# Altium schematic sheet 配套图1.SchDoc
size A3
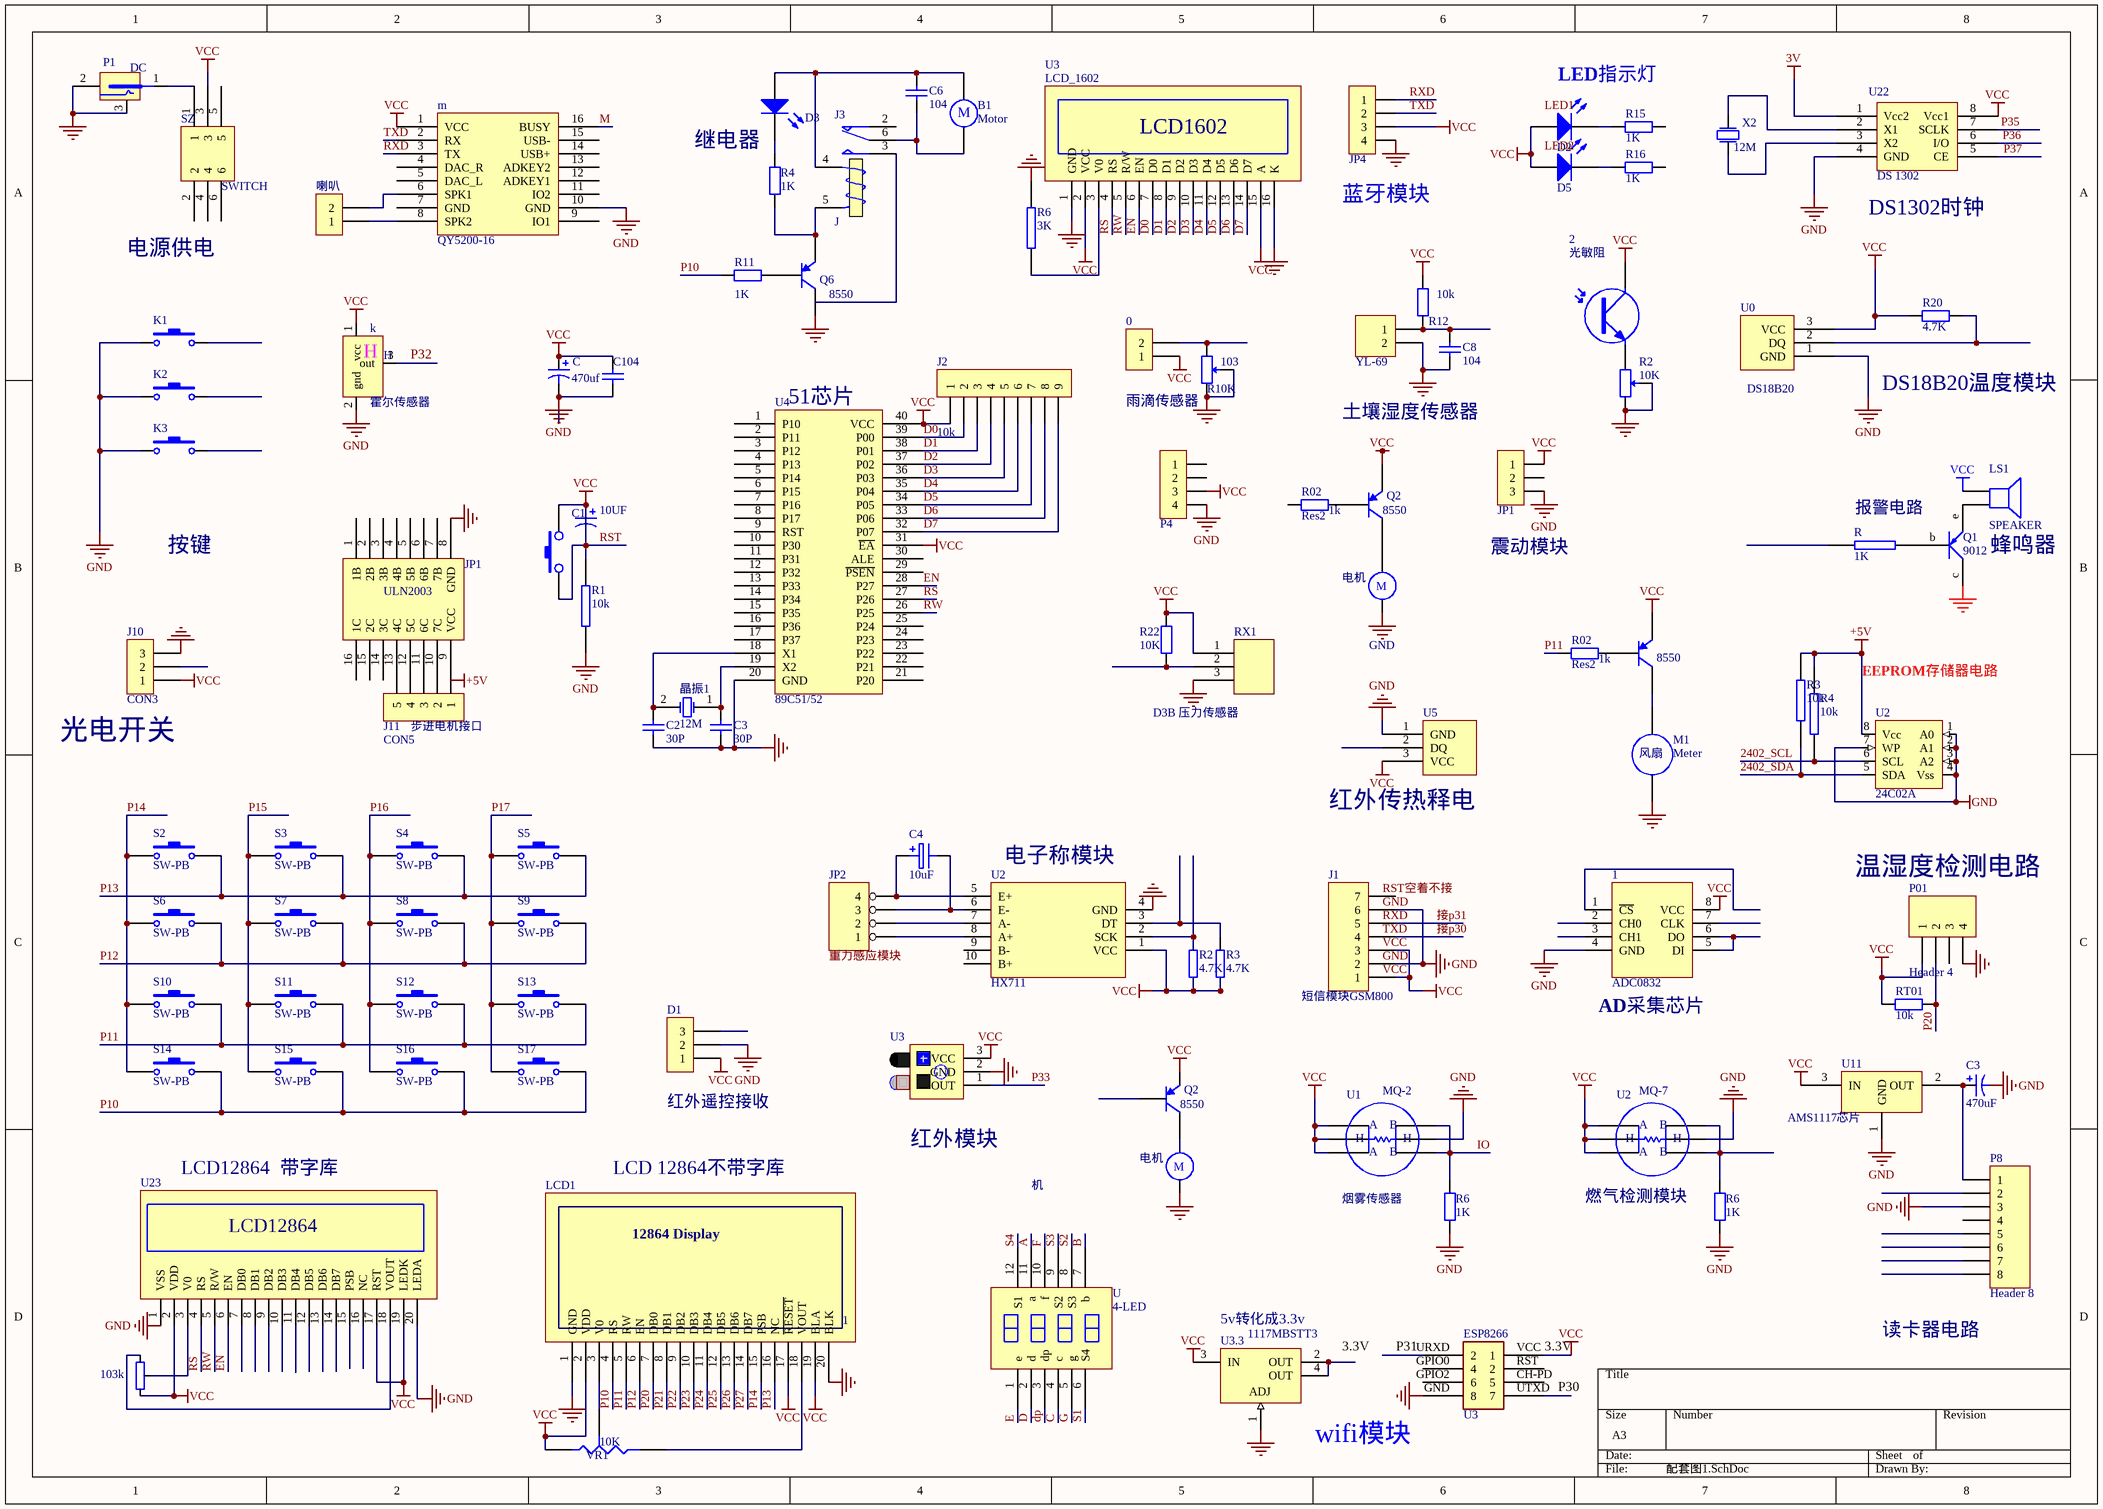
[diagram p0: 配套图1.SchDoc]

## Parts
(Parts that share a designator on the sheet are numbered #1, #2 ... from top to bottom, then left to right.)
0  (no value)
1  ADC0832
2  光敏阻
103k  (no value)  [RT1]
?#1  (no value)  [SWITCH]
?#2  8550  [BCY-W3/E4]
B1  Motor  [2ZHEN]
C  value 470uf  [B]
C1  10UF  [CD4]
C2  30P  [CB1]
C3#1  30P  [CB1]
C3#2  470uF  [电解电容]
C4  10uF  [CD5.254]
C6  104  [RAD0.1]
C8  CAP  [CAP-100]  (value not drawn)
C104  (no value)  [CAP]
D1  (no value)
D2  LED  [led]  (value not drawn)
D3  LED  [led]  (value not drawn)
D5  LED  [led]  (value not drawn)
ESP8266  U3  [HDR2X4]
J1  短信模块GSM800  [HDR1X7]
J2  10k  [SIP9]
J3  J  [JIDIANQI]
J10  CON3
J11  CON5  [SIP5]
JP1#1  HDR-1X3  [HDR-1X3]  (value not drawn)
JP1#2  ULN2003  [DIP16]
JP2  (no value)  [SIP4]
JP4  HDR-1X4  [HDR-1X4]  (value not drawn)
k  H  [DS18B20]
K1  KEY  [TSW SMD-4*4*1.5]  (value not drawn)
K2  KEY  [TSW SMD-4*4*1.5]  (value not drawn)
K3  KEY  [TSW SMD-4*4*1.5]  (value not drawn)
LCD1  1  [12864]
LS1  SPEAKER
m  QY5200-16  [QY5200]
M1  Meter  [RAD-0.1]
P1  DC  [DC2.1]
P01  Header 4  [HDR1X4]
P4  HDR-1X4  [HDR-1X4]  (value not drawn)
P8  Header 8  [HDR1X8]
Q1  9012  [TO-92B]
Q2#1  8550  [SJG-EBC]
Q2#2  8550  [SJG-EBC]
Q6  8550  [TO-sanjiguan]
R  1K  [R-DIP]
R1  10k  [1/4W]
R2#1  10K  [VR5]
R02#1  Res2  value 1k  [AXIAL-0.4]
R02#2  Res2  value 1k  [AXIAL-0.4]
R2#2  4.7K  [1/4W]
R3#1  10k  [1/4W]
R3#2  4.7K  [1/4W]
R4#1  1K  [RES]
R4#2  10k  [1/4W]
R6#1  3K  [R-DIP]
R6#2  1K  [RES]
R6#3  1K  [RES]
R10K  103  [VR5]
R11  1K  [AXIAL-0.3]
R12  RES0.4  [RES0.4]  (value not drawn)
R15  1K  [RES]
R16  1K  [RES]
R20  value 4.7K  [直插式电阻]  (hidden comment: Res2)
R22  RES0.4  [AXIAL-0.3]  (value not drawn)
RT01  value 10k  [AXIAL-0.3]  (hidden comment: Res2)
RX1  D3B 压力传感器  [3ZHEN]
S2  SW-PB  [SPST-2]
S3  SW-PB  [SPST-2]
S4  SW-PB  [SPST-2]
S5  SW-PB  [SPST-2]
S6  SW-PB  [SPST-2]
S7  SW-PB  [SPST-2]
S8  SW-PB  [SPST-2]
S9  SW-PB  [SPST-2]
S10  SW-PB  [SPST-2]
S11  SW-PB  [SPST-2]
S12  SW-PB  [SPST-2]
S13  SW-PB  [SPST-2]
S14  SW-PB  [SPST-2]
S15  SW-PB  [SPST-2]
S16  SW-PB  [SPST-2]
S17  SW-PB  [SPST-2]
SZ  SWITCH  [SW6]
U  4-LED  [LED-4]
U0  DS18B20  [TO-92]
U1  MQ-2  [MQ-2]
U2#1  24C02A  [DIP8]
U2#2  HX711  [HX711]
U2#3  MQ-7  [MQ-2]
U3#1  LCD_1602  [LCD1602]
U3#2  (no value)
U3.3  1117MBSTT3  [318E-04]
U4  89C51/52  [DIP40]
U5  红外传热释电  [DS18B20]
U11  AMS1117芯片  [AMS1117]
U22  DS 1302  [DS1302 - duplicate]
U23  LCD12864  带字库  [SIP20]
VR1  12864  [RW]  (value not drawn)
X2  12M  [XTAL-3X10]
喇叭  (no value)
土壤湿度传感器  YL-69  [2ZHEN]
晶振1  12M  [JZ2]
电机#1  GND  [RB5-10.5]
电机#2  机  [RB5-10.5]

## Nets
3.3V: 0.1 1.8(VCC) 2.1(C) 103k.2 ?#1.1 ?#1.2 ?#2.1(E) C.1 C1.1 C1.2 C104.2 D1.1 D2.1(A) D5.1(A) ESP8266.VCC(1) J1.1 J1.3 J2.1 J10.1 JP1#1.1 JP4.3 k.1(vcc) LCD1.2(VDD) LCD1.17(~{RESET}) LCD1.19(BLA) LS1.1 m.1(VCC) P01.1 P4.3 Q2#1.1(E) R1.1 R2#2.1 R3#2.1 R12.2 R20.1 R22.2 RT01.2 RX1.1 SZ.3 U0.3(VCC) U1.1 U1.2 U1.3 U2#2.1(VCC) U2#3.1 U2#3.2 U2#3.3 U3#1.2(VCC) U3#1.15(A) U3#2.3(VCC) U3.3.3(IN) U4.31(~{EA}) U4.40(VCC) U5.3(VCC) U11.3(IN) U22.8(Vcc1) U23.2(VDD) U23.17(RST) U23.19(LEDK) VR1.1  [also labelled RST, VCC]
3V: U22.1(Vcc2)
+5V: JP1#2.9(VCC) R3#1.2 R4#2.2 U2#1.8(Vcc)
GND: 1.4(GND) C.2 C2.1 C3#1.1 C8.2 C104.1 D1.2 ESP8266.GND(8) J1.2 J1.6 J10.3 JP1#1.3 JP1#2.8(GND) JP4.4 k.2(gnd) K1.1 K2.1 K3.1 LCD1.1(GND) LCD1.20(BLK) m.10(GND) M1.1 P1.2 P1.3 P01.4 P4.4 P8.3 Q1.c Q6.1(C) R1.2 R2#1.2 R2#1.3 R6#1.1 R6#2.1 R6#3.1 R10K.2 R10K.3 RX1.3(-1) U0.1(GND) U1.5 U2#1.1(A0) U2#1.2(A1) U2#1.3(A2) U2#1.4(Vss) U2#1.7(WP) U2#2.4(GND) U2#3.5 U3#1.1(GND) U3#1.16(K) U3#2.2(GND) U3.3.1(ADJ) U4.20(GND) U5.1(GND) U22.4(GND) U23.1(VSS) U23.20(LEDA) 土壤湿度传感器.2
2402_SCL: R4#2.1 U2#1.6(SCL)
2402_SDA: R3#1.1 U2#1.5(SDA)
A: U.11(a)
B: U.7(b)
C: U.4(c)
D: U.2(d)
D0: J2.2 U3#1.7(D0) U4.39(P00)
D1: J2.3 U3#1.8(D1) U4.38(P01)
D2: J2.4 U3#1.9(D2) U4.37(P02)
D3: J2.5 U3#1.10(D3) U4.36(P03)
D4: J2.6 U3#1.11(D4) U4.35(P04)
D5: J2.7 U3#1.12(D5) U4.34(P05)
D6: J2.8 U3#1.13(D6) U4.33(P06)
D7: J2.9 U3#1.14(D7) U4.32(P07)
dp: U.3(dp)
E: U.1(e)
EN: U3#1.6(EN) U4.28(P27) U23.6(EN)
F: U.10(f)
G: U.5(g)
IO: R6#2.2 U1.4 U1.6
M: m.16(BUSY)
P10: LCD1.4(RS) R11.1 S14.2 S15.2 S16.2 S17.2
P11: LCD1.5(RW) R02#2.1 S10.2 S11.2 S12.2 S13.2
P12: LCD1.6(EN) S6.2 S7.2 S8.2 S9.2
P13: LCD1.16(NC) S2.2 S3.2 S4.2 S5.2
P14: LCD1.15(PSB) S2.1 S6.1 S10.1 S14.1
P15: S3.1 S7.1 S11.1 S15.1
P16: S4.1 S8.1 S12.1 S16.1
P17: S5.1 S9.1 S13.1 S17.1
P20: LCD1.7(DB0) P01.2 RT01.1
P21: LCD1.8(DB1)
P22: LCD1.9(DB2)
P23: LCD1.10(DB3)
P24: LCD1.11(DB4)
P25: LCD1.12(DB5)
P26: LCD1.13(DB6)
P27: LCD1.14(DB7)
P30: ESP8266.UTXD(7)
P31: ESP8266.URXD(2)
P32: k.3(out)
P33: U3#2.1(OUT)
P35: U22.7(SCLK)
P36: U22.6(I/O)
P37: U22.5(CE)
RS: U3#1.4(RS) U4.27(P26) U23.4(RS)
RW: U3#1.5(R/W) U4.26(P25) U23.5(R/W)
RXD: JP4.1 m.3(TX)
S1: U.6(S4)
S2: U.8(S3)
S3: U.9(S2)
S4: U.12(S1)
TXD: JP4.2 m.2(RX)
接p30: J1.4
接p31: J1.5
Net0_2: 0.2 R10K.1
Net1_5: 1.5(DI) 1.6(DO)
Net103k_1: 103k.1 U23.18(VOUT)
Net103k_3: 103k.3 U23.3(V0)
Net?#2_2: ?#2.2(B) R02#2.2
Net?#2_3: ?#2.3(C) M1.2
NetB1_1: B1.1 C6.2 D3.1(A) J3.4(T1)
NetB1_2: B1.2 C6.1 J3.6(COM)
NetC2_2: C2.2 U4.18(X1) 晶振1.2(OSC2)
NetC3#1_2: C3#1.2 U4.19(X2) 晶振1.1(OSC1)
NetC3#2_1: C3#2.1 P8.1 U11.2(OUT)
NetC4_1: C4.1 JP2.4 U2#2.5(E+)
NetC4_2: C4.2 JP2.3 U2#2.6(E-)
NetC8_1: C8.1 R12.1 土壤湿度传感器.1
NetD2_2: D2.2(K) R15.2
NetD3_2: D3.2(K) R4#1.2
NetD5_2: D5.2(K) R16.2
NetJ3_5: J3.5(T2) Q6.3(E) R4#1.1
NetJP2_1: JP2.1 U2#2.8(A+)
NetJP2_2: JP2.2 U2#2.7(A-)
NetLCD1_3: LCD1.3(V0) VR1.2
NetLCD1_18: LCD1.18(VOUT) VR1.3
NetLS1_2: LS1.2 Q1.e
Netm_6: m.6(SPK1) 喇叭.2
Netm_8: m.8(SPK2) 喇叭.1
NetP1_1: P1.1 SZ.1
NetQ1_b: Q1.b R.1
NetQ2#1_2: Q2#1.2(B) R02#1.2
NetQ2#1_3: Q2#1.3(C) 电机#1.1
NetQ6_2: Q6.2(B) R11.2
NetR2#2_2: R2#2.2 U2#2.2(SCK)
NetR3#2_2: R3#2.2 U2#2.3(DT)
NetR6#1_2: R6#1.2 U3#1.3(V0)
NetR6#3_2: R6#3.2 U2#3.4 U2#3.6
NetR20_2: R20.2 U0.2(DQ)
NetR22_1: R22.1 RX1.2
NetU3.3_2: U3.3.2(OUT) U3.3.4(OUT)
NetU22_2: U22.2(X1) X2.1(P1)
NetU22_3: U22.3(X2) X2.2(P2)

Not connected (* = marked no-connect by the designer): 1 1(~{CS}) 2(CH0) 3(CH1) 7(CLK); 2 2(E); C3#2 2; D1 3; ESP8266 CH-PD(5) GPIO0(4) GPIO2(6) RST(2); J1 7; J3 2(NC) 3(NO); J10 2; J11 1 2 3 4 5; JP1#1 2; JP1#2 1(1B) 2(2B) 3(3B) 4(4B) 5(5B) 6(6B) 7(7B) 10(7C) 11(6C) 12(5C) 13(4C) 14(3C) 15(2C) 16(1C); K1 2; K2 2; K3 2; m 4(DAC_R) 5(DAC_L) 7(GND) 9(IO1) 11(IO2) 12(ADKEY1) 13(ADKEY2) 14(USB+) 15(USB-); P01 3; P4 1 2; P8 2 4 5 6 7 8; Q2#2 1(E) 2(B) 3(C); R 2; R2#1 1; R02#1 1; R15 1; R16 1; SZ 2 4 5 6; U2#2 9(B-) 10(B+); U4 1(P10) 2(P11) 3(P12) 4(P13) 5(P14) 6(P15) 7(P16) 8(P17) 9(RST) 10(P30) 11(P31) 12(P32) 13(P33) 14(P34) 15(P35) 16(P36) 17(P37) 21(P20) 22(P21) 23(P22) 24(P23) 25(P24) 29(~{PSEN}) 30(ALE); U5 2(DQ); U11 1(GND); U23 7(DB0) 8(DB1) 9(DB2) 10(DB3) 11(DB4) 12(DB5) 13(DB6) 14(DB7) 15(PSB) 16(NC); 电机#1 2; 电机#2 1 2

## Notes on the sheet
- LED指示灯
- 继电器
- (near U3#1) LCD1602
- 蓝牙模块
- (near U22) DS1302时钟
- 电源供电
- (near U4) 51芯片
- DS18B20温度模块
- 按键
- 蜂鸣器
- EEPROM存储器电路
- (near J10) 光电开关
- (near J11) 步进电机接口
- (near M1) 风扇
- 温湿度检测电路
- (near 1) AD采集芯片
- (near U3#2) 红外模块
- (near U3.3) 5v转化成3.3v
- 读卡器电路
- (near U3.3) wifi模块
- Labels drawn without touching a wire or pin: 3.3V, GND, LCD 12864不带字库, LED1, LED2, RST空着不接, RXD, TXD, VCC, 报警电路, 烟雾传感器, 燃气检测模块, 电子称模块, 红外遥控接收, 重力感应模块, 雨滴传感器, 震动模块, 霍尔传感器
- (in symbol CAP) 104
- (in symbol LCD12864-CK) 12864 Display
- (in symbol Motor) M
- (in symbol MQ-2) A; B; H
- (in symbol RES0.4) 10k; 10K
- (in symbol RES-TAP) 10K

## Library data of the parts
0 喇叭 = CON2: Connector
2 = NPN-PHOTO
103k = RT
?#1 = SW-PB
?#2 = 2N3906: PNP General Purpose Amplifier; Published: 8-Jun-2000; LatestRevisionDate: 15-Jan-2003; LatestRevisionNote: PCB Footprint 'BCY-W3/D4.7' replaced; DatasheetDocument: 1997; PackageReference: TO-92A; Publisher: Altium Limited; Code_JEDEC: TO-92A
B1 电机#1 电机#2 = Motor: Motor, General Kind; Published: 24-Mar-1999; LatestRevisionDate: 17-Jul-2002; LatestRevisionNote: Re-released for DXP Platform.; PackageReference: RB5-10.5; Publisher: Altium Limited
C C3#2 = Cap Pol1: Polarized Capacitor (Radial); Published: 8-Jun-2000; LatestRevisionDate: 17-Jul-2002; LatestRevisionNote: Re-released for DXP Platform.; PackageReference: RB7.6-15; Publisher: Altium Limited
  C3#2: Value: 470uF
C1 = C1
C2 C3#1 = C
C4 = ELECTRO1: Electrolytic Capacitor
C6 = CAP
C104 = Cap: Capacitor; Published: 8-Jun-2000; LatestRevisionDate: 17-Jul-2002; LatestRevisionNote: Re-released for DXP Platform.; PackageReference: RAD-0.3; Publisher: Altium Limited
D1 J10 = CON3: Connector
D2 D3 D5 = LED0: Typical INFRARED GaAs LED; Published: 8-Jun-2000; LatestRevisionDate: 08-Jul-2005; LatestRevisionNote: Mech Layer 1 removed.; PackageReference: LED-0; Publisher: Altium Limited
ESP8266 = CZ8
J1 = Header 7: Header, 7-Pin; LatestRevisionDate: 17-Jul-2002; LatestRevisionNote: Re-released for DXP Platform.; Publisher: Altium Limited
J2 = CON9: Connector
J3 = jidianqi
J11 = CON5: Connector
JP1#1 = Header 3: 3P接插件; 版权归属: 源创客; BOM名称: 3P接插件; 学习资源: www.ooocke.com
JP2 = 4 HEADER: 4 Pin Header
JP4 P4 = Header 4: 4P接插件; 版权归属: 源创客; BOM名称: 4P接插件; 学习资源: www.ooocke.com
LCD1 = LCD12864-CK
m = YX5200-16
M1 = Meter: Indicating Instrument; Note: Place a "letter" into the symbol to show the function of the meter or instrument; Published: 24-Mar-1999; LatestRevisionDate: 17-Jul-2002; LatestRevisionNote: Re-released for DXP Platform.; Publisher: Altium Limited
P1 = POWER
P01 = Header 4: Header, 4-Pin; LatestRevisionDate: 17-Jul-2002; LatestRevisionNote: Re-released for DXP Platform.; Publisher: Altium Limited
P8 = Header 8: Header, 8-Pin; LatestRevisionDate: 17-Jul-2002; LatestRevisionNote: Re-released for DXP Platform.; Publisher: Altium Limited
Q1 Q2#1 Q2#2 Q6 = PNP
R R1 R2#2 R3#1 R3#2 R4#2 R6#1 = RES2
R2#1 R10K = RR
R02#1 R02#2 R4#1 R15 R16 R20 RT01 = Res2: Resistor; Published: 8-Jun-2000; LatestRevisionDate: 17-Jul-2002; LatestRevisionNote: Re-released for DXP Platform.; Publisher: Altium Limited
  R4#1 R15 R16: PackageReference: AXIAL-0.4; Value: 1K
  R20: PackageReference: AXIAL-0.4
R6#2 R6#3 = Res
R11 = RES0.4
RX1 = 3ZHEN-4
S2-S17 = SW-PB: Switch; Published: 24-Mar-1999; LatestRevisionDate: 17-Jul-2002; LatestRevisionNote: Re-released for DXP Platform.; PackageReference: SPST-2; Publisher: Altium Limited
U = 4-LED7
U2#1 = 24LC64_1: Text Field1: 50; Text Field2: 50
U2#3 = MQ-2
U3#1 = LCM1602
U3#2 = FC-51: Value: FC-51光电开关
U3.3 = LM317MBSTT3: Three-Terminal Adjustable Output Positive Voltage Regulator; Note: Pin 2 is electrically connected to Pin 4 (TAB); Published: 15-Apr-2002; DatasheetVersion: Nov-1999; PackageVersion: Nov-1999; PackageReference: 318E-04; Publisher: Altium Limited; PackageDescription: SOT-223/SC-73; 4 Leads; Body 6.7 x 7.3 mm, inc. leads (LxW max); ComponentLink1Description: Manufacturer Link; ComponentLink1URL: http://www.onsemi.com/site/products/taxonomy/0,4438,503,00.html; ComponentLink2Description: Datasheet; ComponentLink2URL: http://www.onsemi.com/pub/Collateral/LM317M-D.PDF
U4 = STC89C52
U5 = DS18B20
U11 = AMS1117
U22 = DS1302
U23 = LCD12864
VR1 = RES-TAP
X2 = 1: Crystal Oscillator
土壤湿度传感器 = 2  zhen: Header, 2-Pin; LatestRevisionDate: 17-Jul-2002; LatestRevisionNote: Re-released for DXP Platform.; Publisher: Altium Limited
晶振1 = JZ